# Altium schematic sheet Peripherals.SchDoc
size A; SheetNumber: 4; SheetTotal: 4
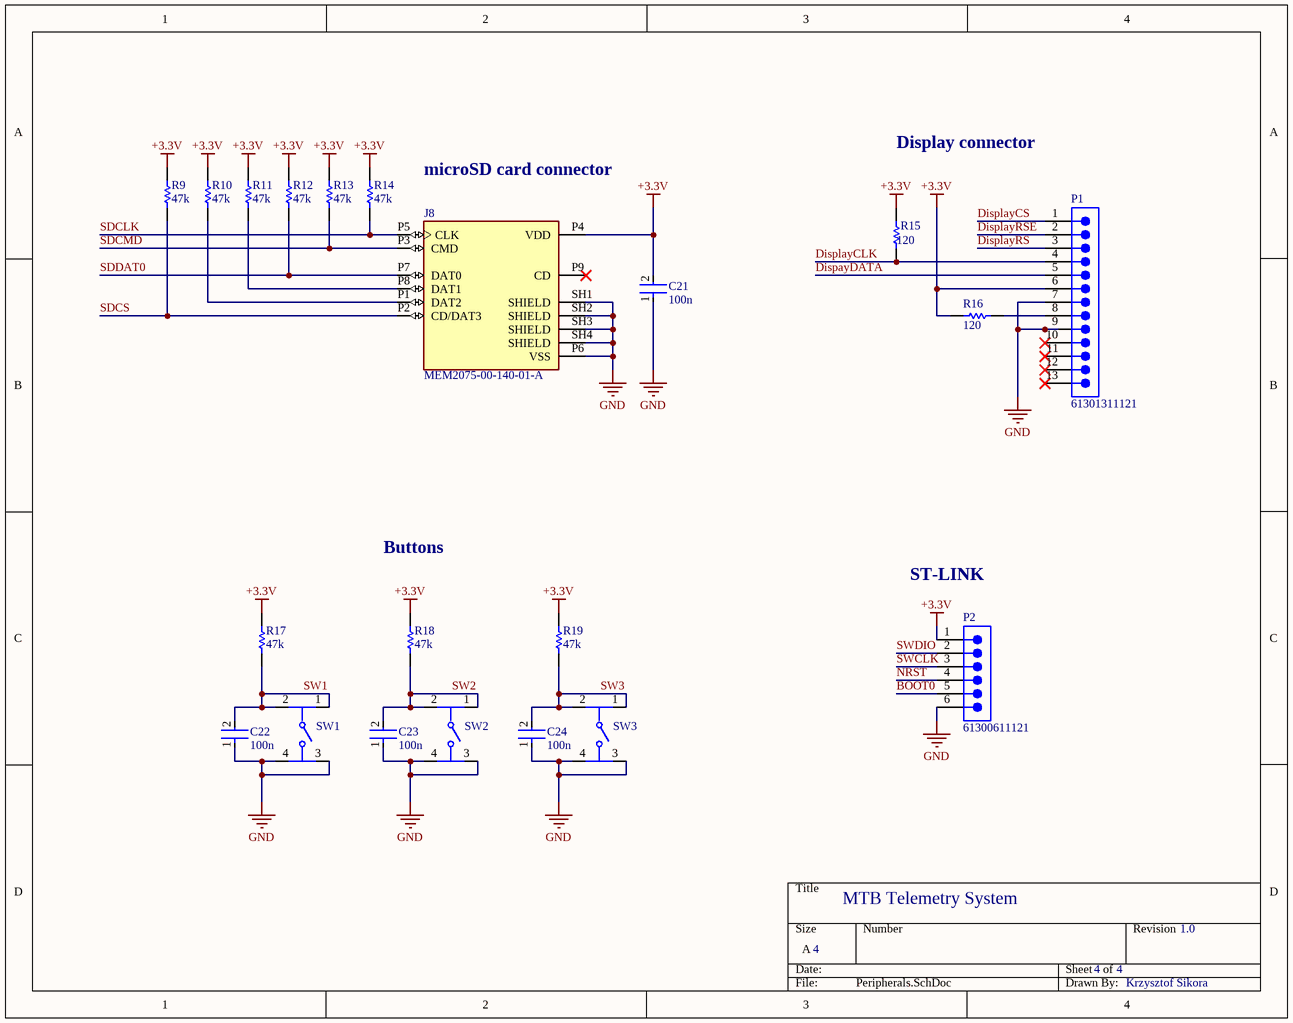
[diagram p0: Peripherals.SchDoc]

## Parts
C21  100n  [FP-C0603C-CF-MFG]
C22  100n  [FP-C0603C-CF-MFG]
C23  100n  [FP-C0603C-CF-MFG]
C24  100n  [FP-C0603C-CF-MFG]
J8  MEM2075-00-140-01-A  [GCT_MEM2075-00-140-01-A]
P1  61301311121  [61301311121]
P2  61300611121  [61300611121]
R9  47k  [RESC2013X60X35ML10T20]
R10  47k  [RESC2013X60X35ML10T20]
R11  47k  [RESC2013X60X35ML10T20]
R12  47k  [RESC2013X60X35ML10T20]
R13  47k  [RESC2013X60X35ML10T20]
R14  47k  [RESC2013X60X35ML10T20]
R15  120  [RESC2013X60X35ML10T20]
R16  120  [RESC2013X60X35ML10T20]
R17  47k  [RESC2013X60X35ML10T20]
R18  47k  [RESC2013X60X35ML10T20]
R19  47k  [RESC2013X60X35ML10T20]
SW1  1-1825910-0  [FP-1-1825910-0-MFG]  (value not drawn)
SW2  1-1825910-0  [FP-1-1825910-0-MFG]  (value not drawn)
SW3  1-1825910-0  [FP-1-1825910-0-MFG]  (value not drawn)

## Nets
+3.3V: C21.2 J8.P4(VDD) P1.6 P2.1 R9.2 R10.2 R11.2 R12.2 R13.2 R14.2 R15.1 R16.2 R17.2 R18.2 R19.2
GND: C21.1 C22.1 C23.1 C24.1 J8.P6(VSS) J8.SH1(SHIELD) J8.SH2(SHIELD) J8.SH3(SHIELD) J8.SH4(SHIELD) P1.7 P1.9 P2.6 SW1.3 SW1.4 SW2.3 SW2.4 SW3.3 SW3.4
BOOT0: P2.5
DispayDATA: P1.5
DisplayCLK: P1.4 R15.2
DisplayCS: P1.1
DisplayRS: P1.3
DisplayRSE: P1.2
NRST: P2.4
SDCLK: J8.P5(CLK) R14.1
SDCMD: J8.P3(CMD) R13.1
SDCS: J8.P2(CD/DAT3) R9.1
SDDAT0: J8.P7(DAT0) R12.1
SW1: C22.2 R17.1 SW1.1 SW1.2
SW2: C23.2 R18.1 SW2.1 SW2.2
SW3: C24.2 R19.1 SW3.1 SW3.2
SWCLK: P2.3
SWDIO: P2.2
NetJ8_P1: J8.P1(DAT2) R10.1
NetJ8_P8: J8.P8(DAT1) R11.1
NetP1_8: P1.8 R16.1

Not connected (* = marked no-connect by the designer): J8 P9(CD)*; P1 10* 11* 12* 13*

## Notes on the sheet
- Display connector
- microSD card connector
- Buttons
- ST-LINK
- MTB Telemetry System
- 4
- 1.0
- Krzysztof Sikora

## Library data of the parts
C21-C24 = CMP-2006-03061-2: CAP CER 0.1UF 50V X7R 0603; Manufacturer: KEMET; Manufacturer Part Number: C0603C104K5RACTU; Tolerance: 0.1; Temperature Coefficient: 30ppm/°C; Material: Ceramic; Automotive Grade: Grade 1; Value: 0.10 μF; Temperature: -55°C to +125°C; RoHS: TRUE; Temperature Range High: +125°C; Lead Free: Yes; Octopart: https://octopart.com/c0603c104k5ractu-kemet-139244; Digikey Description: CAP CER 0.1UF 50V X7R 0603; Category: Cap; Package: C0603C-CF; ComponentLink2Description: Datasheet; Temperature Range Low: -55°C; Device Class L1: Passive Components; Voltage Rating: 50 V; Automotive: Yes; Device Class L3: Ceramic Capacitors; ComponentLink2URL: https://api.kemet.com/component-edge/download/datasheet/C0603C100J5GACAUTO.pdf; Capacitance: 0.10 μF; Device Class L2: Capacitors; Temperature Characteristic: X7R; Height: 0.87mm
J8 = MEM2075-00-140-01-A: Micro SD Memory Card Connector, 1.4mm Profile SMT, Push-Push, with Normally open Switch; MP: MEM2075-00-140-01-A; Value: *; Price: None; Package: None; Availability: Unavailable
P1 = CMP-1502-01089-2: NexarPartId: 32855541; Current Rating: 3A; Gender: Male; Pitch: 2.54mm; Contact Resistance: 20mΩ; Connector Type: Male Pin; Operating Supply Voltage: 250V; Number of Positions: 13; Contact Material: Copper; Number of Rows: 1; Lead Pitch: 2.54mm; Termination: Solder; Packaging: Bulk; Color: Black; Mount: Through Hole; Orientation: Vertical; RoHS: Compliant; Number of Pins: 13; Lead Free: Lead Free; Contact Mating Length: 5.9944mm; Contact Plating: Gold; REACH SVHC: Unknown; Number of Contacts: 13
P2 = CMP-1502-01070-2: NexarPartId: 20084590; Operating Supply Voltage: 250V; Current Rating: 3A; Number of Contacts: 6; Gender: Male; Connector Type: Male Pin; Pitch: 2.54mm; Contact Resistance: 20mΩ; Lead Free: Lead Free; REACH SVHC: Unknown; Number of Rows: 1; Color: Black; Min Operating Temperature: -40°C; Contact Material: Copper; Lead Pitch: 2.54mm; Contact Plating: Gold; Number of Pins: 6; Height: 8.89mm; Orientation: Vertical; Termination: Through Hole; Mount: Through Hole; RoHS: Compliant; Contact Gender: Male; Contact Mating Length: 5.9944mm; Voltage Rating: 250V; Number of Positions: 6; Housing Material: PBT; Packaging: Bulk; Max Operating Temperature: 105°C
R9-R19 = CMP-2100-03673-1: Chip Resistor, 0 Ohm, Jumper, +/- 5%, 0.125 W, -55 to 155 degC, 0805 (2012 Metric), RoHS, Tape and Reel; Manufacturer: Yageo; Power Rating: 125mW; Resistance: 0mOhm; Voltage Rating (DC): 150V; Temperature Coefficient: 200ppm/degreesC; Height: 0.5mm; Depth: 1.25mm; Case Code (Imperial): 0805; Lead Free: LeadFree; Military Standard: Not; Package Description: 2-Pin Surface Mounted Device, Body 2 x 1.25 mm; Case Code (Metric): 2012; Composition: ThickFilm; Voltage Rating: 150V; Manufacturer URL: http://www.yageo.com/; Packaging: TapeandReel; Package Reference: 0805; REACH SVHC: Unknown; Tolerance: 5%; Case/Package: 0805; Max Operating Temperature: 155degC; Number of Pins: 2; Min Operating Temperature: -55degC; RoHSCompliant: true; Length: 2mm; Datasheet URL: http://www.yageo.com/NewPortal/yageodocoutput?fileName=/pdf/R-Chip/PYu-RC_Group_51_RoHS_L_5.pdf; Termination: SMD/SMT; Radiation Hardening: No; Width: 1.25mm; Contact Plating: Tin; Datasheet Version: Rev. 5, 10/2016
SW1-SW3 = CMP-03407-000018-1: SWITCH TACTILE SPST-NO 0.05A 24V; Switch Function: Off-Mom; Mechanical Life: 100000Cycles; Actuator Material: Nylon; Actuator Color: Blue; Contact Current Rating: 50mA; Illumination Type: Non-Illuminated; Throw Configuration: SPST; Actuator Length: 3.4mm; Operating Force: 1.56N; Actuator Type: Standard; Contact Resistance: 100mR; Switch Travel: 0.25mm; Depth: 5.99mm; Contact Plating: Silver; Max Operating Temperature: 85°C; Electrical Life: 100000Cycles; Min Operating Temperature: -35°C; RoHS Compliant: Yes; Max Voltage Rating (DC): 24V; Mount: Through Hole; Packaging: Loose Piece; Length: 5.99mm; Series: FSMJ, Alcoswitch; Orientation: Straight; Contact Material: Brass; Radiation Hardening: No; Package Quantity: 750; Max Current Rating: 50mA; Termination: PC Pins; Type: Switch; Voltage Rating (DC): 24V